# Altium schematic sheet 4-PCIe.SchDoc
size A3; SheetNumber: 4; SheetTotal: 5
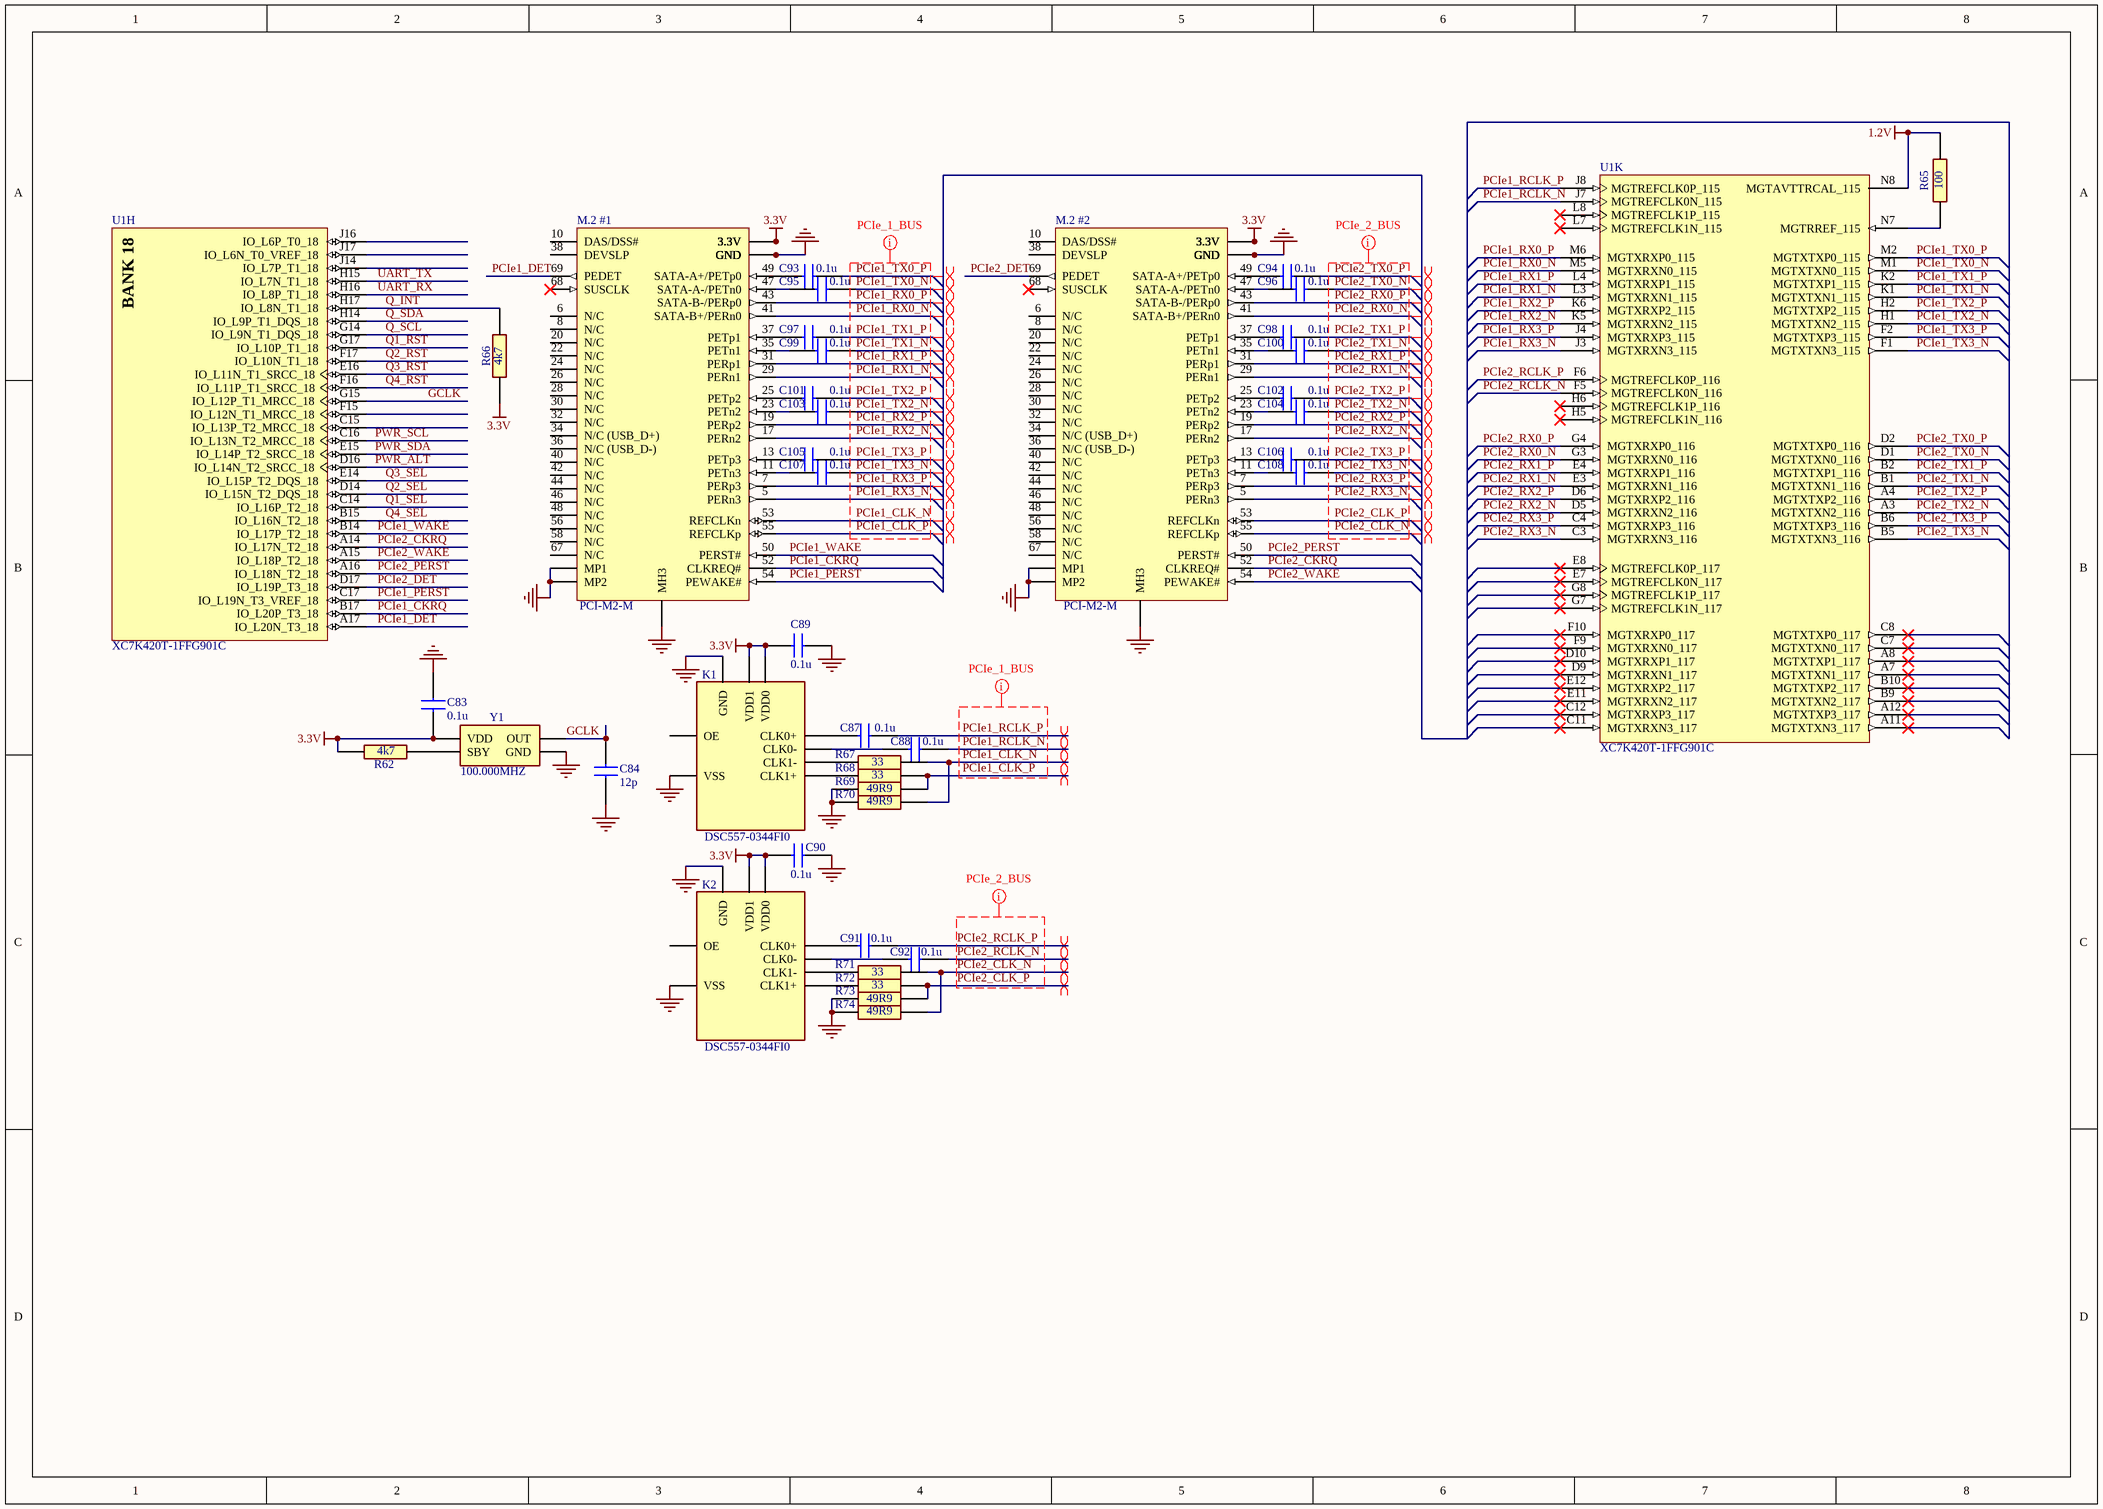
[diagram p0: 4-PCIe.SchDoc]

## Parts
C83  0.1u  [SMD0402]
C84  12p  [SMD0402]
C87  0.1u  [SMD0402]
C88  0.1u  [SMD0402]
C89  0.1u  [SMD0402]
C90  0.1u  [SMD0402]
C91  0.1u  [SMD0402]
C92  0.1u  [SMD0402]
C93  0.1u  [SMD0402]
C94  0.1u  [SMD0402]
C95  0.1u  [SMD0402]
C96  0.1u  [SMD0402]
C97  0.1u  [SMD0402]
C98  0.1u  [SMD0402]
C99  0.1u  [SMD0402]
C100  0.1u  [SMD0402]
C101  0.1u  [SMD0402]
C102  0.1u  [SMD0402]
C103  0.1u  [SMD0402]
C104  0.1u  [SMD0402]
C105  0.1u  [SMD0402]
C106  0.1u  [SMD0402]
C107  0.1u  [SMD0402]
C108  0.1u  [SMD0402]
K1  DSC557-0344FI0  [QFN50P250X320X90-15N]
K2  DSC557-0344FI0  [QFN50P250X320X90-15N]
M.2_#1  PCI-M2-M  [PCIE-M2-M]
M.2_#2  PCI-M2-M  [PCIE-M2-M]
R62  4k7  [SMD0402]
R65  100  [SMD0402]
R66  4k7  [SMD0402]
R67  33  [SMD0402]
R68  33  [SMD0402]
R69  49R9  [SMD0402]
R70  49R9  [SMD0402]
R71  33  [SMD0402]
R72  33  [SMD0402]
R73  49R9  [SMD0402]
R74  49R9  [SMD0402]
U1  XC7K420T-1FFG901C  [FFG901]  (parts H,K of 16)
Y1  100.000MHZ  [ASEM1100000MHZLCT]

## Nets
1.2V: R65.2 U1.N8(MGTAVTTRCAL_115)
3.3V: C83.1 C89.2 C90.2 K1.12(VDD0) K1.13(VDD1) K2.12(VDD0) K2.13(VDD1) M.2_#1.2(3.3V) M.2_#1.4(3.3V) M.2_#1.12(3.3V) M.2_#1.14(3.3V) M.2_#1.16(3.3V) M.2_#1.18(3.3V) M.2_#1.70(3.3V) M.2_#1.72(3.3V) M.2_#1.74(3.3V) M.2_#2.2(3.3V) M.2_#2.4(3.3V) M.2_#2.12(3.3V) M.2_#2.14(3.3V) M.2_#2.16(3.3V) M.2_#2.18(3.3V) M.2_#2.70(3.3V) M.2_#2.72(3.3V) M.2_#2.74(3.3V) R62.1 R66.1 Y1.4(VDD)
GND: C83.2 C84.1 C89.1 C90.1 K1.4(VSS) K1.15(GND) K2.4(VSS) K2.15(GND) M.2_#1.1(GND) M.2_#1.3(GND) M.2_#1.9(GND) M.2_#1.15(GND) M.2_#1.21(GND) M.2_#1.27(GND) M.2_#1.33(GND) M.2_#1.39(GND) M.2_#1.45(GND) M.2_#1.51(GND) M.2_#1.57(GND) M.2_#1.71(GND) M.2_#1.73(GND) M.2_#1.75(GND) M.2_#1.MH3 M.2_#1.MP1 M.2_#1.MP2 M.2_#2.1(GND) M.2_#2.3(GND) M.2_#2.9(GND) M.2_#2.15(GND) M.2_#2.21(GND) M.2_#2.27(GND) M.2_#2.33(GND) M.2_#2.39(GND) M.2_#2.45(GND) M.2_#2.51(GND) M.2_#2.57(GND) M.2_#2.71(GND) M.2_#2.73(GND) M.2_#2.75(GND) M.2_#2.MH3 M.2_#2.MP1 M.2_#2.MP2 R69.1 R70.1 R73.1 R74.1 Y1.2(GND)
GCLK: C84.2 U1.G15(IO_L12P_T1_MRCC_18) Y1.3(OUT)
PCIe1_CKRQ: M.2_#1.52(CLKREQ#) U1.B17(IO_L20P_T3_18)
PCIe1_CLK_N: M.2_#1.53(REFCLKn) R67.1 R70.2
PCIe1_CLK_P: M.2_#1.55(REFCLKp) R68.1 R69.2
PCIe1_DET: M.2_#1.69(PEDET) U1.A17(IO_L20N_T3_18)
PCIe1_PERST: M.2_#1.54(PEWAKE#) U1.C17(IO_L19N_T3_VREF_18)
PCIe1_RCLK_N: C88.1 U1.J7(MGTREFCLK0N_115)
PCIe1_RCLK_P: C87.1 U1.J8(MGTREFCLK0P_115)
PCIe1_RX0_N: M.2_#1.41(SATA-B+/PERn0) U1.M5(MGTXRXN0_115)
PCIe1_RX0_P: M.2_#1.43(SATA-B-/PERp0) U1.M6(MGTXRXP0_115)
PCIe1_RX1_N: M.2_#1.29(PERn1) U1.L3(MGTXRXN1_115)
PCIe1_RX1_P: M.2_#1.31(PERp1) U1.L4(MGTXRXP1_115)
PCIe1_RX2_N: M.2_#1.17(PERn2) U1.K5(MGTXRXN2_115)
PCIe1_RX2_P: M.2_#1.19(PERp2) U1.K6(MGTXRXP2_115)
PCIe1_RX3_N: M.2_#1.5(PERn3) U1.J3(MGTXRXN3_115)
PCIe1_RX3_P: M.2_#1.7(PERp3) U1.J4(MGTXRXP3_115)
PCIe1_TX0_N: C95.1 U1.M1(MGTXTXN0_115)
PCIe1_TX0_P: C93.1 U1.M2(MGTXTXP0_115)
PCIe1_TX1_N: C99.1 U1.K1(MGTXTXN1_115)
PCIe1_TX1_P: C97.1 U1.K2(MGTXTXP1_115)
PCIe1_TX2_N: C103.1 U1.H1(MGTXTXN2_115)
PCIe1_TX2_P: C101.1 U1.H2(MGTXTXP2_115)
PCIe1_TX3_N: C107.1 U1.F1(MGTXTXN3_115)
PCIe1_TX3_P: C105.1 U1.F2(MGTXTXP3_115)
PCIe1_WAKE: M.2_#1.50(PERST#) U1.B14(IO_L17P_T2_18)
PCIe2_CKRQ: M.2_#2.52(CLKREQ#) U1.A14(IO_L17N_T2_18)
PCIe2_CLK_N: M.2_#2.55(REFCLKp) R71.1 R74.2
PCIe2_CLK_P: M.2_#2.53(REFCLKn) R72.1 R73.2
PCIe2_DET: M.2_#2.69(PEDET) U1.D17(IO_L19P_T3_18)
PCIe2_PERST: M.2_#2.50(PERST#) U1.A16(IO_L18N_T2_18)
PCIe2_RCLK_N: C92.1 U1.F5(MGTREFCLK0N_116)
PCIe2_RCLK_P: C91.1 U1.F6(MGTREFCLK0P_116)
PCIe2_RX0_N: M.2_#2.41(SATA-B+/PERn0) U1.G3(MGTXRXN0_116)
PCIe2_RX0_P: M.2_#2.43(SATA-B-/PERp0) U1.G4(MGTXRXP0_116)
PCIe2_RX1_N: M.2_#2.29(PERn1) U1.E3(MGTXRXN1_116)
PCIe2_RX1_P: M.2_#2.31(PERp1) U1.E4(MGTXRXP1_116)
PCIe2_RX2_N: M.2_#2.17(PERn2) U1.D5(MGTXRXN2_116)
PCIe2_RX2_P: M.2_#2.19(PERp2) U1.D6(MGTXRXP2_116)
PCIe2_RX3_N: M.2_#2.5(PERn3) U1.C3(MGTXRXN3_116)
PCIe2_RX3_P: M.2_#2.7(PERp3) U1.C4(MGTXRXP3_116)
PCIe2_TX0_N: C96.1 U1.D1(MGTXTXN0_116)
PCIe2_TX0_P: C94.1 U1.D2(MGTXTXP0_116)
PCIe2_TX1_N: C100.1 U1.B1(MGTXTXN1_116)
PCIe2_TX1_P: C98.1 U1.B2(MGTXTXP1_116)
PCIe2_TX2_N: C104.1 U1.A3(MGTXTXN2_116)
PCIe2_TX2_P: C102.1 U1.A4(MGTXTXP2_116)
PCIe2_TX3_N: C108.1 U1.B5(MGTXTXN3_116)
PCIe2_TX3_P: C106.1 U1.B6(MGTXTXP3_116)
PCIe2_WAKE: M.2_#2.54(PEWAKE#) U1.A15(IO_L18P_T2_18)
PWR_ALT: U1.D16(IO_L14N_T2_SRCC_18)
PWR_SCL: U1.C16(IO_L13N_T2_MRCC_18)
PWR_SDA: U1.E15(IO_L14P_T2_SRCC_18)
Q1_RST: U1.G17(IO_L10P_T1_18)
Q1_SEL: U1.C14(IO_L16P_T2_18)
Q2_RST: U1.F17(IO_L10N_T1_18)
Q2_SEL: U1.D14(IO_L15N_T2_DQS_18)
Q3_RST: U1.E16(IO_L11N_T1_SRCC_18)
Q3_SEL: U1.E14(IO_L15P_T2_DQS_18)
Q4_RST: U1.F16(IO_L11P_T1_SRCC_18)
Q4_SEL: U1.B15(IO_L16N_T2_18)
Q_INT: R66.2 U1.H17(IO_L8N_T1_18)
Q_SCL: U1.G14(IO_L9N_T1_DQS_18)
Q_SDA: U1.H14(IO_L9P_T1_DQS_18)
UART_RX: U1.H16(IO_L8P_T1_18)
UART_TX: U1.H15(IO_L7N_T1_18)
NetC87_2: C87.2 K1.11(CLK0+)
NetC88_2: C88.2 K1.10(CLK0-)
NetC91_2: C91.2 K2.11(CLK0+)
NetC92_2: C92.2 K2.10(CLK0-)
NetC93_2: C93.2 M.2_#1.49(SATA-A+/PETp0)
NetC94_2: C94.2 M.2_#2.49(SATA-A+/PETp0)
NetC95_2: C95.2 M.2_#1.47(SATA-A-/PETn0)
NetC96_2: C96.2 M.2_#2.47(SATA-A-/PETn0)
NetC97_2: C97.2 M.2_#1.37(PETp1)
NetC98_2: C98.2 M.2_#2.37(PETp1)
NetC99_2: C99.2 M.2_#1.35(PETn1)
NetC100_2: C100.2 M.2_#2.35(PETn1)
NetC101_2: C101.2 M.2_#1.25(PETp2)
NetC102_2: C102.2 M.2_#2.25(PETp2)
NetC103_2: C103.2 M.2_#1.23(PETn2)
NetC104_2: C104.2 M.2_#2.23(PETn2)
NetC105_2: C105.2 M.2_#1.13(PETp3)
NetC106_2: C106.2 M.2_#2.13(PETp3)
NetC107_2: C107.2 M.2_#1.11(PETn3)
NetC108_2: C108.2 M.2_#2.11(PETn3)
NetK1_8: K1.8(CLK1+) R68.2
NetK1_9: K1.9(CLK1-) R67.2
NetK2_8: K2.8(CLK1+) R72.2
NetK2_9: K2.9(CLK1-) R71.2
NetR62_2: R62.2 Y1.1(SBY)
NetR65_1: R65.1 U1.N7(MGTRREF_115)

Not connected (* = marked no-connect by the designer): K1 1(OE) 2(NC_1) 3(NC_2) 5(NC_3) 6(NC_4) 7(NC_5) 14(NC_6); K2 1(OE) 2(NC_1) 3(NC_2) 5(NC_3) 6(NC_4) 7(NC_5) 14(NC_6); M.2_#1 6(N/C) 8(N/C) 10(DAS/DSS#) 20(N/C) 22(N/C) 24(N/C) 26(N/C) 28(N/C) 30(N/C) 32(N/C) 34(N/C_(USB_D+)) 36(N/C_(USB_D-)) 38(DEVSLP) 40(N/C) 42(N/C) 44(N/C) 46(N/C) 48(N/C) 56(N/C) 58(N/C) 67(N/C) 68(SUSCLK)*; M.2_#2 6(N/C) 8(N/C) 10(DAS/DSS#) 20(N/C) 22(N/C) 24(N/C) 26(N/C) 28(N/C) 30(N/C) 32(N/C) 34(N/C_(USB_D+)) 36(N/C_(USB_D-)) 38(DEVSLP) 40(N/C) 42(N/C) 44(N/C) 46(N/C) 48(N/C) 56(N/C) 58(N/C) 67(N/C) 68(SUSCLK)*; U1 A7(MGTXTXN1_117)* A8(MGTXTXP1_117)* A11(MGTXTXN3_117)* A12(MGTXTXP3_117)* B9(MGTXTXN2_117)* B10(MGTXTXP2_117)* C7(MGTXTXN0_117)* C8(MGTXTXP0_117)* C11(MGTXRXN3_117)* C12(MGTXRXP3_117)* C15(IO_L13P_T2_MRCC_18) D9(MGTXRXN1_117)* D10(MGTXRXP1_117)* E7(MGTREFCLK0N_117)* E8(MGTREFCLK0P_117)* E11(MGTXRXN2_117)* E12(MGTXRXP2_117)* F9(MGTXRXN0_117)* F10(MGTXRXP0_117)* F15(IO_L12N_T1_MRCC_18) G7(MGTREFCLK1N_117)* G8(MGTREFCLK1P_117)* H5(MGTREFCLK1N_116)* H6(MGTREFCLK1P_116)* J14(IO_L7P_T1_18) J16(IO_L6P_T0_18) J17(IO_L6N_T0_VREF_18) L7(MGTREFCLK1N_115)* L8(MGTREFCLK1P_115)*

## Layout directives
differential pair; differential pair class PCIe_2_DIF: PCIe2_CLK_N, PCIe2_CLK_P, PCIe2_RCLK_N, PCIe2_RCLK_P, PCIe2_RX0_N, PCIe2_RX0_P, PCIe2_RX1_N, PCIe2_RX1_P, PCIe2_RX2_N, PCIe2_RX2_P, PCIe2_RX3_N, PCIe2_RX3_P, PCIe2_TX0_N, PCIe2_TX0_P, PCIe2_TX1_N, PCIe2_TX1_P, PCIe2_TX2_N, PCIe2_TX2_P, PCIe2_TX3_N, PCIe2_TX3_P
differential pair; differential pair class PCIe_1_DIF: PCIe1_CLK_N, PCIe1_CLK_P, PCIe1_RCLK_N, PCIe1_RCLK_P, PCIe1_RX0_N, PCIe1_RX0_P, PCIe1_RX1_N, PCIe1_RX1_P, PCIe1_RX2_N, PCIe1_RX2_P, PCIe1_RX3_N, PCIe1_RX3_P, PCIe1_TX0_N, PCIe1_TX0_P, PCIe1_TX1_N, PCIe1_TX1_P, PCIe1_TX2_N, PCIe1_TX2_P, PCIe1_TX3_N, PCIe1_TX3_P
net class PCIe_1_BUS: PCIe1_CLK_N, PCIe1_CLK_P, PCIe1_RCLK_N, PCIe1_RCLK_P, PCIe1_RX0_N, PCIe1_RX0_P, PCIe1_RX1_N, PCIe1_RX1_P, PCIe1_RX2_N, PCIe1_RX2_P, PCIe1_RX3_N, PCIe1_RX3_P, PCIe1_TX0_N, PCIe1_TX0_P, PCIe1_TX1_N, PCIe1_TX1_P, PCIe1_TX2_N, PCIe1_TX2_P, PCIe1_TX3_N, PCIe1_TX3_P
net class PCIe_2_BUS: PCIe2_CLK_N, PCIe2_CLK_P, PCIe2_RCLK_N, PCIe2_RCLK_P, PCIe2_RX0_N, PCIe2_RX0_P, PCIe2_RX1_N, PCIe2_RX1_P, PCIe2_RX2_N, PCIe2_RX2_P, PCIe2_RX3_N, PCIe2_RX3_P, PCIe2_TX0_N, PCIe2_TX0_P, PCIe2_TX1_N, PCIe2_TX1_P, PCIe2_TX2_N, PCIe2_TX2_P, PCIe2_TX3_N, PCIe2_TX3_P

## Notes on the sheet
- (in symbol XC7K420T-1FFG901C, part H) BANK 18

## Library data of the parts
C83 C84 C87-C108 = CAP 0402: Capacitor
K1 K2 = DSC557-0344FI0: Integrated Circuit; Manufacturer_Name: Microchip; Datasheet Link: http://ww1.microchip.com/downloads/en/devicedoc/dsc557-03%20datasheet%20mkqbpd12091701-2.pdf; Height: 0.9mm; Manufacturer_Part_Number: DSC557-0344FI0; Mouser Part Number: 998-DSC557-0344FI0; Mouser Price/Stock: https://www.mouser.com/Search/Refine.aspx?Keyword=998-DSC557-0344FI0; Arrow Part Number: DSC557-0344FI0; Arrow Price/Stock: https://www.arrow.com/en/products/dsc557-0344fi0/microchip-technology
M.2_#1 M.2_#2 = PCI-M2-M: M.2 Key M Socket 3; Manufacturer_Name: Amphenol; Manufacturer_Part_Number: MDT275M02001; Datasheet Link: https://www.mouser.com/datasheet/2/18/Amphenol_CMDTXXXXXX001-4-1157232.pdf; Height: 2.75mm
R62 R65-R74 = RES 0402: Resistor
U1 = XC7K420T-1FFG901C: Kintex-7 FPGA, 400 User I/Os, 28 GTX, 900-Ball BGA, Speed Grade 1, Commercial Grade, Pb-Free; Manufacturer: Xilinx; GTX: 28; SelectIO HP: 0; SelectIO HR: 380; Speed Grade: -1; DatasheetVersion: v1.12; PackageVersion: Rev 1.8; PackageReference: FFG901; PackageDescription: Flip-Chip BGA, Body 31 x 31 mm, 1.0 mm Pitch; Generic Part Number: XC7K420T; RoHS: Pb-Free; Mounting Technology: Surface Mount; Code_JEDEC: MS-034-AAN-1; PartNumber: XC7K420T-1FFG901C; ComponentLink1Description: Datasheet; ComponentLink1URL: http://www.xilinx.com/support/documentation/data_sheets/ds180_7Series_Overview.pdf; ComponentLink2Description: Package Specification; ComponentLink2URL: http://www.xilinx.com/support/documentation/user_guides/ug475_7Series_Pkg_Pinout.pdf
Y1 = ASEM1-100.000MHZ-L-C-T: Crystal or Oscillator; Manufacturer_Name: ABRACON; Datasheet Link: https://eu.mouser.com/datasheet/2/3/ASEM-44258.pdf; Height: 0.9mm; Manufacturer_Part_Number: ASEM1-100.000MHZ-L-C-T; Mouser Part Number: 815-ASEM1-100.0-LCT; Mouser Price/Stock: https://www.mouser.co.uk/ProductDetail/ABRACON/ASEM1-100000MHZ-L-C-T?qs=DmEoDMSjLQrIUu25gcXRZw%3D%3D